# Altium schematic sheet power.SchDoc
size A; SheetNumber: 4; SheetTotal: 4
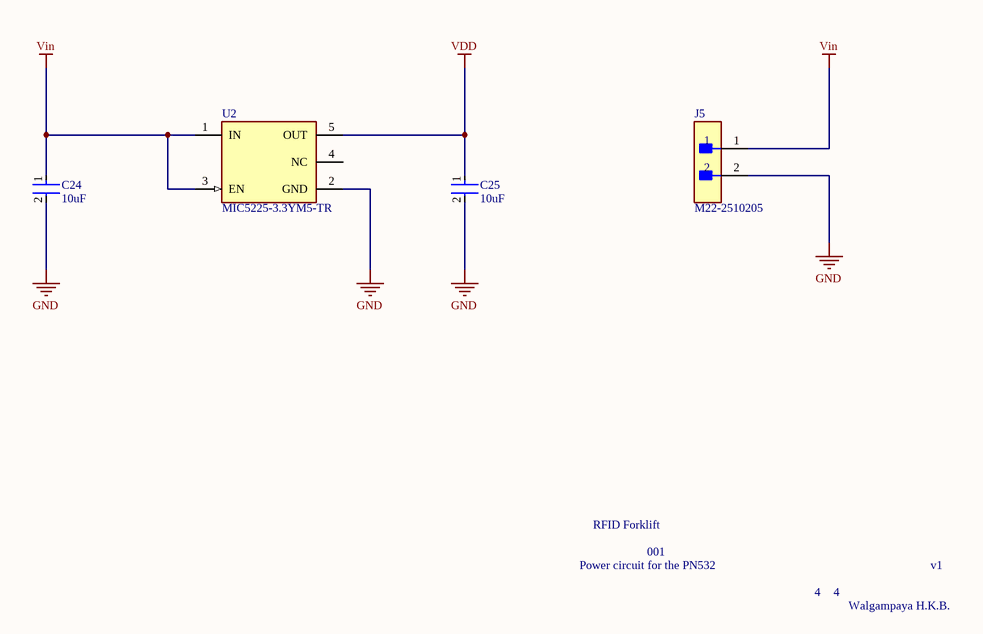
[diagram p0: power.SchDoc]

## Parts
C24  10uF  [FP-CC1206-0_3-1_45-IPC_C]
C25  10uF  [FP-CC1206-0_3-1_45-IPC_C]
J5  M22-2510205  [FP-M22-2510205-MFG]
U2  MIC5225-3.3YM5-TR  [FP-SOT23-5LD-PL-1-MFG]

## Nets
GND: C24.2 C25.2 J5.2 U2.2(GND)
VDD: C25.1 U2.5(OUT)
Vin: C24.1 J5.1 U2.1(IN) U2.3(EN)

Not connected (* = marked no-connect by the designer): U2 4(NC)

## Notes on the sheet
- RFID Forklift
- Power circuit for the PN532
- 001
- 4
- v1
- Walgampaya H.K.B.

## Library data of the parts
C24 C25 = CMP-2000-05436-2: CAP CER 1000PF 2KV X7R 1206; Capacitance: 1nF; Insulation Resistance: 10GR; Dissipation Factor: 2.5%; Tolerance: 10%; Termination: SMD/SMT; Voltage Rating (DC): 2kV; Case/Package: 1206; Length: 3.2mm; Depth: 1.6mm; Case Code (Imperial): 1206; Package Quantity: 1; Packaging: Tape and Reel; Dielectric: X7R; Mount: Surface Mount; Max Operating Temperature: 125°C; Lead Free: Lead Free; Number of Pins: 2; Thickness: 0.057inch; Width: 0.063inch; Resistor Type: Ceramic; Series: CC; RoHS Compliant: Yes; Voltage Rating: 2kV; Radiation Hardening: No; Construction: Flat; Height: 1.25mm; Min Operating Temperature: -55°C; Voltage: 2kV; Case Code (Metric): 3216
J5 = CMP-15831-000005-1: CONN HEADER VERT 2POS 2MM; Manufacturer: Harwin; Conn Gender: Male; Current Rating: 2A; Number Of Contacts: 2; Conn Orientation: Vertical; Temperature Range Low: -40°C; Device Class L1: Connectors; ComponentLink2URL: https://cdn.harwin.com/pdfs/C018XX_M22_Series_Connectors.pdf; Temperature Range High: +105°C; Pitch: 2mm; Number Of Rows: 1; Temperature: -40°C to +105°C; Automotive: No; Device Class L3: unset; Octopart: https://octopart.com/m22-2510205-harwin-2538221; Mouser Description: Headers & Wire Housings 2 PIN SIL VERTICAL GOLD PIN HEADER; Height: 5.45mm; Category: Conn; Digikey Description: CONN HEADER VERT 2POS 2MM; Contact Material: Gold,Nickel; Lead Free: Yes; ComponentLink2Description: Datasheet; Manufacturer Part Number: M22-2510205; Device Class L2: Headers and Wire Housings; Package: 0; Footprint Url: https://cdn.harwin.com/pdfs/M22-251.pdf; RoHS: TRUE
U2 = CMP-06324-000013-1: IC REG LINEAR 3.3V 150MA SOT23-5; Manufacturer: Microchip Technology; Max Supply Voltage: 16V; Output Type: Fixed; Accuracy Percentage: 1%; Number Of Outputs: 1; Standoff Height: 0mm; Min Supply Voltage: 2.3V; Dropout Voltage: 310mV; Max Junction Temp: +125°C; Nominal Supply Current: 29-3000uA; Output Current: 150mA; Height: 1.45mm; Device Class L3: Voltage Regulators - Linear; Temperature Range High: +125°C; Temperature Range Low: -40°C; Device Class L2: Power Management ICs; Device Class L1: Integrated Circuits (ICs); Manufacturer Part Number: MIC5225-3.3YM5-TR; Output Voltage: 3.3V; ComponentLink2Description: Datasheet; Package: SOT23-5LD-PL-1; ComponentLink2URL: http://ww1.microchip.com/downloads/en/DeviceDoc/mic5225.pdf; Mouser Description: LDO Voltage Regulators High Vin, Low Iq Regulator (Lead Free); RoHS: TRUE; Automotive: No; Temperature: -40°C to +125°C; Category: IC; Octopart: https://octopart.com/mic5225-3.3ym5-tr-microchip-66802280; Lead Free: Yes; Digikey Description: IC REG LINEAR 3.3V 150MA SOT23-5